# EAGLE design hs-64-spi-3d (EAGLE 9.6.2)
DESIGNER: JON NEWMAN, JAKOB VOIGTS; DESIGN_NAME: HEADSTAGE-64; LICENSE: CERN OHL v1.2; REVISION: 1.2
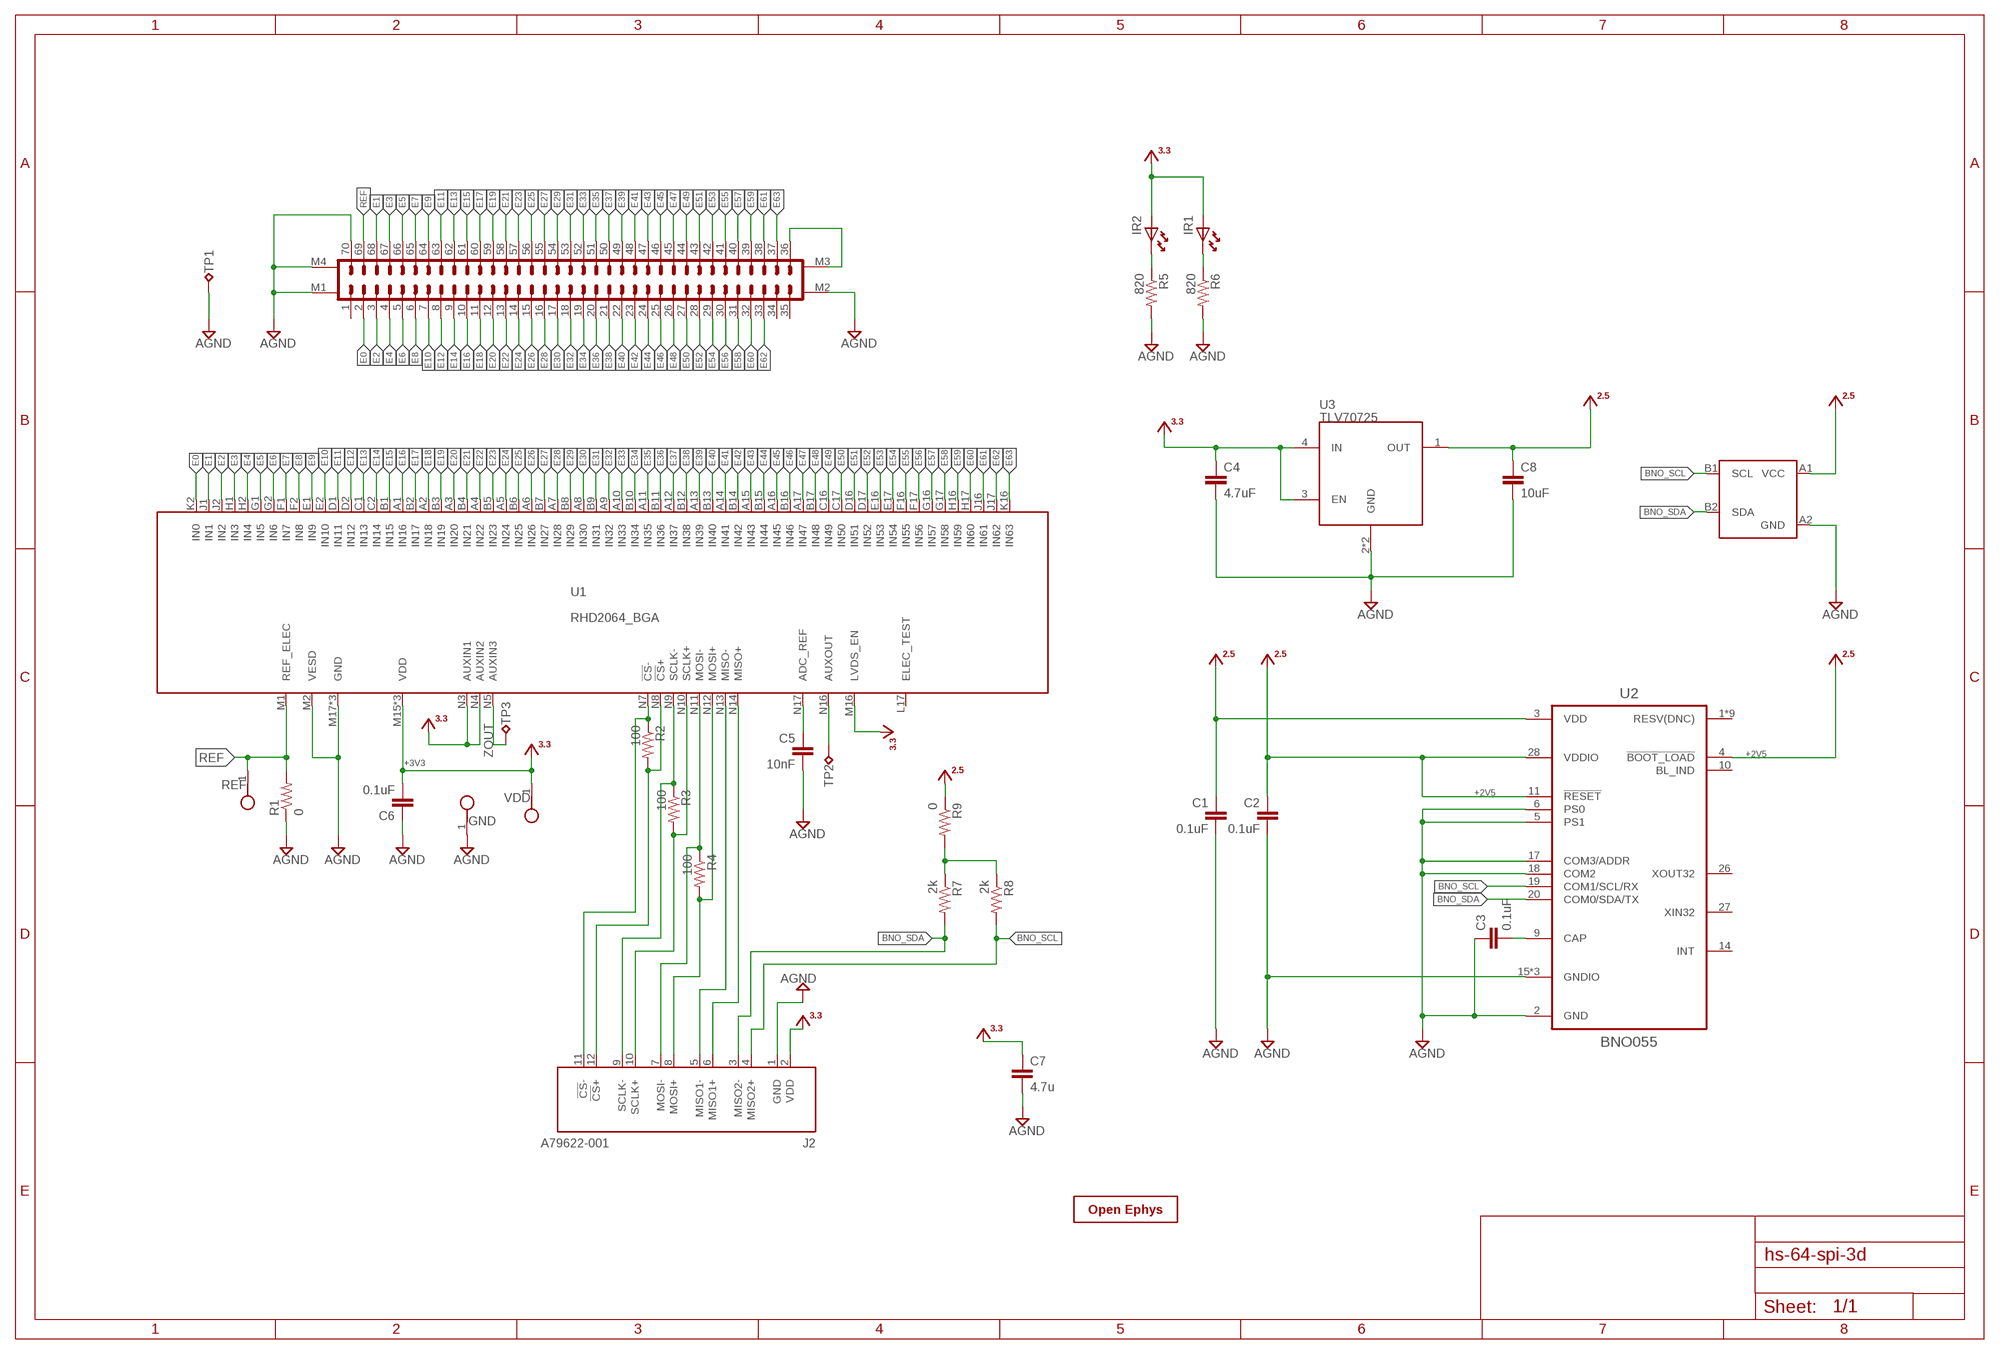
[diagram p0: schematic, sheet 1]

## Parts
C1  0.1uF  C_0402T  [0402T]
C2  0.1uF  C_0402T  [0402T]
C3  0.1uF  C_0201T  [0201T]
C4  4.7uF  C_0402T  [0402T]
C5  10nF  C_0402T  [0402T]
C6  0.1uF  C_0402T  [0402T]
C7  4.7u  C_0402  [0402]
C8  10uF  C_0402T  [0402T]
GND  TESTPOINT_SMALL  [TESTPOINT_SMALL]
IR1  LEDHAND  [LED_HAND]
IR2  LEDHAND  [LED_HAND]
J1  DF40C-70DP-0.4V(51)  PINHD-2X35+4DF40-70HEAD-LESS-SILK  [DF40-70HEAD-LESS-SILK]
J2  A79622-001  [A79622-001]
R1  0  R_0603  [0603]
R2  100  R_0402  [0402]
R3  100  R_0402  [0402]
R4  100  R_0402  [0402]
R5  820  R_0402  [0402]
R6  820  R_0402  [0402]
R7  2k  R_0201T  [0201T]
R8  2k  R_0201T  [0201T]
R9  0  R_0201T  [0201T]
REF  TESTPOINT_SMALL  [TESTPOINT_SMALL]
TP1  VCC  TPTP07R  [TP07R]
TP2  VCC  TPTP07R  [TP07R]
TP3  VCC  TPTP07R  [TP07R]
U1  RHD2064_BGA  RHD2164_BGA_BGA  [BGA104_0.5MM]
U2  BNO055  [LGA-28-3.8X5.2]
U3  TLV70725  TLV707  [X2SON]
U4  24CW640T-I/CS0668  [4-BALL_WAFFER_0.4MMX0.4MM]
VDD  TESTPOINT_SMALL  [TESTPOINT_SMALL]
X  OE-LOGO_3.5X2.5  [OE-LOGO-3.5X2.5]

## Nets
+2V5: C1.1 C2.1 C8.1 R9.1 U2.3(VDD) U2.4(!BOOT_LOAD) U2.11(!RESET) U2.28(VDDIO) U3.1(OUT) U4.A1(VCC)
+3V3: C4.1 C6.2 C7.1 IR1.A IR2.A J2.2(VDD) U1.M15(VDD) U1.M16(LVDS_EN) U1.N2(VDD) U1.N3(AUXIN1) U1.N4(AUXIN2) U1.N15(VDD) U3.3(EN) U3.4(IN) VDD.1
AGND: C1.2 C2.2 C3.1 C4.2 C5.2 C6.1 C7.2 C8.2 GND.1 J1.70 J1.M1 J1.M2 J1.M4 J2.1(GND) R1.1 R5.2 R6.2 TP1.TP U1.M2(VESD) U1.M17(GND) U1.N1(GND) U1.N6(GND) U2.2(GND) U2.5(PS1) U2.6(PS0) U2.15(GNDIO) U2.16(GNDIO) U2.17(COM3/ADDR) U2.18(COM2) U2.25(GNDIO) U3.2(GND) U3.PAD(GND) U4.A2(GND)
BNO_SCL: J2.4(MISO2+) R8.2 U2.19(COM1/SCL/RX) U4.B1(SCL)
BNO_SDA: J2.3(MISO2-) R7.2 U2.20(COM0/SDA/TX) U4.B2(SDA)
E0: J1.2 U1.K2(IN0)
E1: J1.68 U1.J1(IN1)
E2: J1.3 U1.J2(IN2)
E3: J1.67 U1.H1(IN3)
E4: J1.4 U1.H2(IN4)
E5: J1.66 U1.G1(IN5)
E6: J1.5 U1.G2(IN6)
E7: J1.65 U1.F1(IN7)
E8: J1.6 U1.F2(IN8)
E9: J1.64 U1.E1(IN9)
E10: J1.7 U1.E2(IN10)
E11: J1.63 U1.D1(IN11)
E12: J1.8 U1.D2(IN12)
E13: J1.62 U1.C1(IN13)
E14: J1.9 U1.C2(IN14)
E15: J1.61 U1.B1(IN15)
E16: J1.10 U1.A1(IN16)
E17: J1.60 U1.B2(IN17)
E18: J1.11 U1.A2(IN18)
E19: J1.59 U1.B3(IN19)
E20: J1.12 U1.A3(IN20)
E21: J1.58 U1.B4(IN21)
E22: J1.13 U1.A4(IN22)
E23: J1.57 U1.B5(IN23)
E24: J1.14 U1.A5(IN24)
E25: J1.56 U1.B6(IN25)
E26: J1.15 U1.A6(IN26)
E27: J1.55 U1.B7(IN27)
E28: J1.16 U1.A7(IN28)
E29: J1.54 U1.B8(IN29)
E30: J1.17 U1.A8(IN30)
E31: J1.53 U1.B9(IN31)
E32: J1.18 U1.A9(IN32)
E33: J1.52 U1.A10(IN33)
E34: J1.19 U1.B10(IN34)
E35: J1.51 U1.A11(IN35)
E36: J1.20 U1.B11(IN36)
E37: J1.50 U1.A12(IN37)
E38: J1.21 U1.B12(IN38)
E39: J1.49 U1.A13(IN39)
E40: J1.22 U1.B13(IN40)
E41: J1.48 U1.A14(IN41)
E42: J1.23 U1.B14(IN42)
E43: J1.47 U1.A15(IN43)
E44: J1.24 U1.B15(IN44)
E45: J1.46 U1.A16(IN45)
E46: J1.25 U1.B16(IN46)
E47: J1.45 U1.A17(IN47)
E48: J1.26 U1.B17(IN48)
E49: J1.44 U1.C16(IN49)
E50: J1.27 U1.C17(IN50)
E51: J1.43 U1.D16(IN51)
E52: J1.28 U1.D17(IN52)
E53: J1.42 U1.E16(IN53)
E54: J1.29 U1.E17(IN54)
E55: J1.41 U1.F16(IN55)
E56: J1.30 U1.F17(IN56)
E57: J1.40 U1.G16(IN57)
E58: J1.31 U1.G17(IN58)
E59: J1.39 U1.H16(IN59)
E60: J1.32 U1.H17(IN60)
E61: J1.38 U1.J16(IN61)
E62: J1.33 U1.J17(IN62)
E63: J1.37 U1.K16(IN63)
N$1: R7.1 R8.1 R9.2
N$3: IR2.K R5.1
N$4: IR1.K R6.1
N$36: C5.1 U1.N17(ADC_REF)
N$39: TP2.TP U1.N16(AUXOUT)
N$67: C3.2 U2.9(CAP)
REF: J1.69 R1.2 REF.1 U1.M1(REF_ELEC)
RHD_CLK_N [diff]: J2.9(SCLK-) R3.1 U1.N9(SCLK-)
RHD_CLK_P [diff]: J2.10(SCLK+) R3.2 U1.N10(SCLK+)
RHD_CS_N [diff]: J2.11(!CS!-) R2.1 U1.N7(!CS!-)
RHD_CS_P [diff]: J2.12(!CS!+) R2.2 U1.N8(!CS!+)
RHD_MISO_N [diff]: J2.5(MISO1-) U1.N13(MISO-)
RHD_MISO_P [diff]: J2.6(MISO1+) U1.N14(MISO+)
RHD_MOSI_N [diff]: J2.7(MOSI-) R4.1 U1.N11(MOSI-)
RHD_MOSI_P [diff]: J2.8(MOSI+) R4.2 U1.N12(MOSI+)
VCOAX: J1.36 J1.M3
ZOUT: TP3.TP U1.N5(AUXIN3)
Unconnected: J1.1 J1.34 J1.35 U1.L17(ELEC_TEST) U2.1(RESV(DNC)) U2.7(RESV(DNC)) U2.8(RESV(DNC)) U2.10(BL_IND) U2.12(RESV(DNC)) U2.13(RESV(DNC)) U2.14(INT) U2.21(RESV(DNC)) U2.22(RESV(DNC)) U2.23(RESV(DNC)) U2.24(RESV(DNC)) U2.26(XOUT32) U2.27(XIN32)

## Library data of the parts
C1-C3 C6 C7 = jonnew:C: Capacitor
C4 = jonnew:C: Capacitor; PARTNO: CL05A105KO5NNNC
C5 = jonnew:C: Capacitor; PARTNO: GRM033R71E103KE14D
C8 = jonnew:C: Capacitor; PARTNO: CL05A106MQ5NUNC
GND REF VDD = RHD2000_eval_board:TESTPOINT: PCB Test Point
IR1 IR2 = CNP-miscellaneous:LED
J1 = jonnew:PINHD-2X35+4
J2 = hs-64-spi:A79622-001
R1 = jonnew:R: Resistor; DK: PxxxxHTR-ND; MN: Panasonic; MPN: ERJ-3EKFxxxxV
R2-R9 = jonnew:R: Resistor
TP1-TP3 = jonnew:TP: Test pad
U1 = jonnew:RHD2164_BGA: Intan Technologies RHD2164 chip
U2 = jonnew:BNO055
U3 = jonnew:TLV707
U4 = 24CW640T-I_CS0668:24CW640T-I/CS0668
X = jonnew:OE-LOGO

## Net classes
1 thick: width 0.102 mm
2 diff: width 0.076 mm, drill 0.1 mm, clearance 0.051 mm

## Board
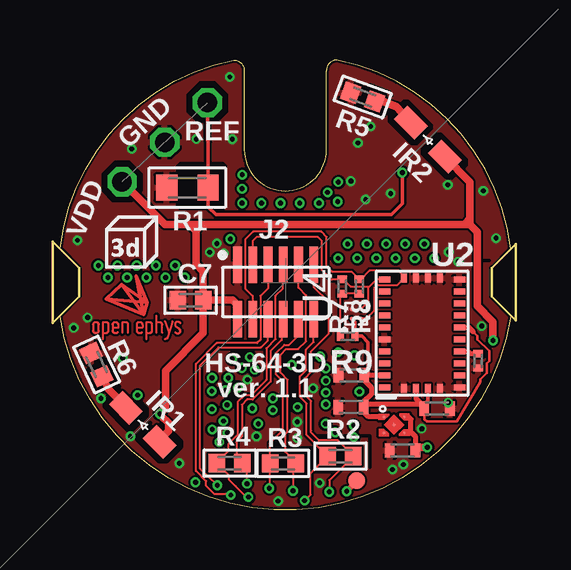
[diagram p1: board, top side]
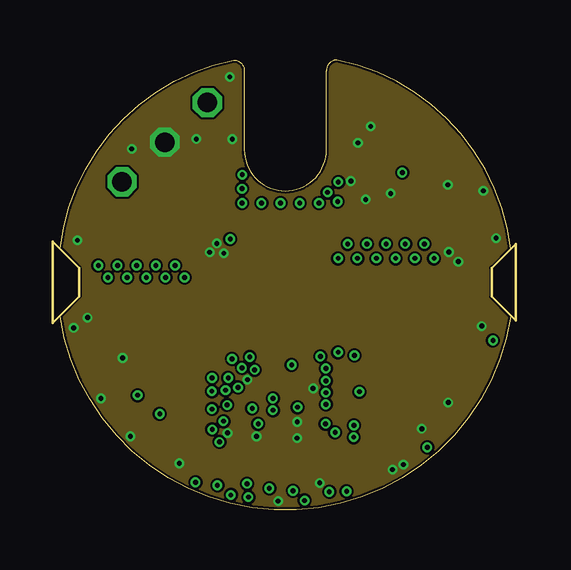
[diagram p2: board, inner layer PWR]
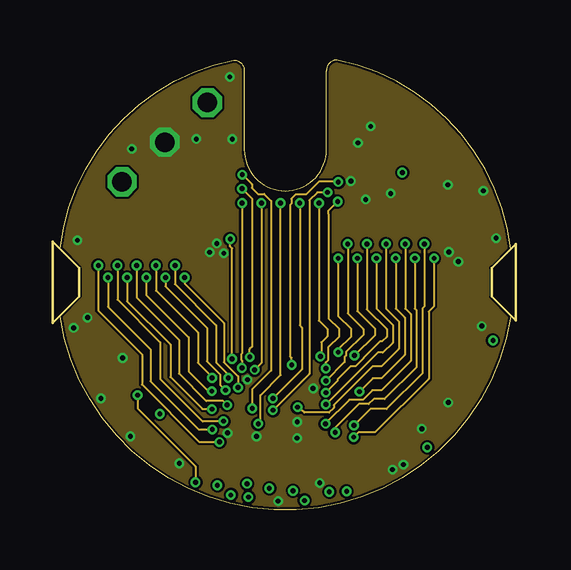
[diagram p3: board, inner layer GND]
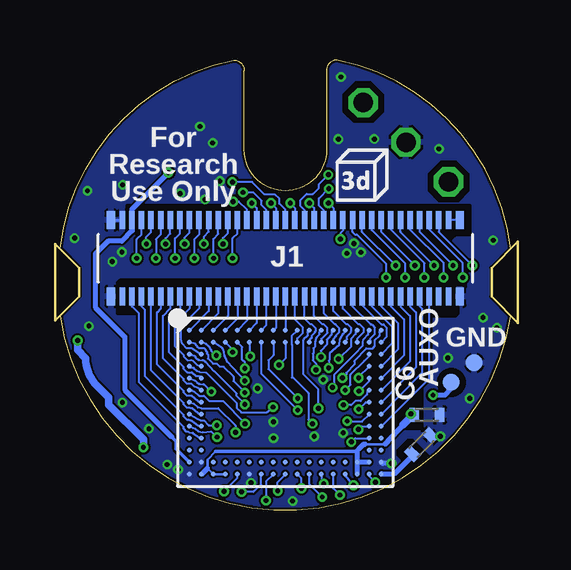
[diagram p4: board, bottom side, seen from below]

Size 18.8 x 18.76 mm. Coordinates in mm from the lower left corner, seen from the top.
Outline: 0,10.89 0.8,10.09 0.8,8.89 0,8.09 arc163 18.8,8.09 18,8.89 18,10.09 18.8,10.89 arc72 11.56,18.76 arc90 11.11,18.32 11.11,15.02 arc-90 9.4,13.3 arc-90 7.69,15.02 7.69,18.32 arc90 7.24,18.76 arc72 0,10.89
Copper layers (1*2+3*16): Top 0.035mm / dielectric 0.2mm / PWR 0.0175mm / dielectric 0.3mm / GND 0.035mm / dielectric 0.2mm / Bottom 0.035mm
Design rules "seeed-studio-4-layer *": minimum track width 0.09mm, minimum drill 0.2mm, track to track 0.09mm, track to pad 0.09mm, pad to pad 0.09mm, via to via 0.09mm, smd to smd 0mil, copper to edge 0.1mm, drill to drill 10mil, minimum pad ring 6mil, minimum via ring 4mil, stop-mask expansion 1mil, vias tented up to drill 100mil, thermal gap 0.1mm
tKeepout: area -0.1,6.6 to 1.4,12.4; area -0.1,6.6 to 1.4,12.4; area 17.4,6.6 to 18.9,12.4; area 17.4,6.6 to 18.9,12.4
tRestrict: 87 lines
bRestrict: area 1.9,4.8 to 3,5.9; 41 lines
Milling: 8 lines

### Footprints (pad centres in the part's own frame; a part is rotated, then mirrored left to right if it is on the bottom)
0402T = smd 0.4 x 0.6: 1 -0.533,0; 2 0.533,0
0201T = smd 0.3 x 0.4: 1 -0.3,0; 2 0.3,0
0402 = smd 0.686 x 0.762: 1 -0.533,0; 2 0.533,0
TESTPOINT_SMALL = drill 0.813 octagon: 1 0,0
LED_HAND = smd 1.2 x 0.8: A -1,0; K 1,0
DF40-70HEAD-LESS-SILK = smd 0.23 x 0.75: 1 -6.8,-1.585; 2 -6.4,-1.585; 3 -6,-1.585; 4 -5.6,-1.585; 5 -5.2,-1.585; 6 -4.8,-1.585; 7 -4.4,-1.585; 8 -4,-1.585; 9 -3.6,-1.585; 10 -3.2,-1.585; 11 -2.8,-1.585; 12 -2.4,-1.585; 13 -2,-1.585; 14 -1.6,-1.585; 15 -1.2,-1.585; 16 -0.8,-1.585; 17 -0.4,-1.585; 18 0,-1.585; 19 0.4,-1.585; 20 0.8,-1.585; 21 1.2,-1.585; 22 1.6,-1.585; 23 2,-1.585; 24 2.4,-1.585; 25 2.8,-1.585; 26 3.2,-1.585; 27 3.6,-1.585; 28 4,-1.585; 29 4.4,-1.585; 30 4.8,-1.585; 31 5.2,-1.585; 32 5.6,-1.585; 33 6,-1.585; 34 6.4,-1.585; 35 6.8,-1.585; 36 6.8,1.585; 37 6.4,1.585; 38 6,1.585; 39 5.6,1.585; 40 5.2,1.585; 41 4.8,1.585; 42 4.4,1.585; 43 4,1.585; 44 3.6,1.585; 45 3.2,1.585; 46 2.8,1.585; 47 2.4,1.585; 48 2,1.585; 49 1.6,1.585; 50 1.2,1.585; 51 0.8,1.585; 52 0.4,1.585; 53 0,1.585; 54 -0.4,1.585; 55 -0.8,1.585; 56 -1.2,1.585; 57 -1.6,1.585; 58 -2,1.585; 59 -2.4,1.585; 60 -2.8,1.585; 61 -3.2,1.585; 62 -3.6,1.585; 63 -4,1.585; 64 -4.4,1.585; 65 -4.8,1.585; 66 -5.2,1.585; 67 -5.6,1.585; 68 -6,1.585; 69 -6.4,1.585; 70 -6.8,1.585 | smd 0.35 x 0.75: M1 -7.275,-1.585; M2 7.275,-1.585; M3 7.275,1.585; M4 -7.275,1.585
A79622-001 = smd 0.36 x 1.524: 1 -1.587,1.143; 2 -1.587,-1.143; 3 -0.953,1.143; 4 -0.953,-1.143; 5 -0.318,1.143; 6 -0.318,-1.143; 7 0.318,1.143; 8 0.318,-1.143; 9 0.953,1.143; 10 0.953,-1.143; 11 1.587,1.143; 12 1.587,-1.143
0603 = smd 0.889 x 1.067: 1 -0.864,0; 2 0.864,0
TP07R = smd 0.7 x 0.7: TP 0,0
BGA104_0.5MM = smd 0.2 x 0.2: A1 -4,3; A2 -3.5,3; A3 -3,3; A4 -2.5,3; A5 -2,3; A6 -1.5,3; A7 -1,3; A8 -0.5,3; A9 0,3; A10 0.5,3; A11 1,3; A12 1.5,3; A13 2,3; A14 2.5,3; A15 3,3; A16 3.5,3; A17 4,3; B1 -4,2.5; B2 -3.5,2.5; B3 -3,2.5; B4 -2.5,2.5; B5 -2,2.5; B6 -1.5,2.5; B7 -1,2.5; B8 -0.5,2.5; B9 0,2.5; B10 0.5,2.5; B11 1,2.5; B12 1.5,2.5; B13 2,2.5; B14 2.5,2.5; B15 3,2.5; B16 3.5,2.5; B17 4,2.5; C1 -4,2; C2 -3.5,2; C16 3.5,2; C17 4,2; D1 -4,1.5; D2 -3.5,1.5; D16 3.5,1.5; D17 4,1.5; E1 -4,1; E2 -3.5,1; E16 3.5,1; E17 4,1; F1 -4,0.5; F2 -3.5,0.5; F16 3.5,0.5; F17 4,0.5; G1 -4,0; G2 -3.5,0; G16 3.5,0; G17 4,0; H1 -4,-0.5; H2 -3.5,-0.5; H16 3.5,-0.5; H17 4,-0.5; J1 -4,-1; J2 -3.5,-1; J16 3.5,-1; J17 4,-1; K1 -4,-1.5; K2 -3.5,-1.5; K16 3.5,-1.5; K17 4,-1.5; L1 -4,-2; L2 -3.5,-2; L16 3.5,-2; L17 4,-2; M1 -4,-2.5; M2 -3.5,-2.5; M3 -3,-2.5; M4 -2.5,-2.5; M5 -2,-2.5; M6 -1.5,-2.5; M7 -1,-2.5; M8 -0.5,-2.5; M9 0,-2.5; M10 0.5,-2.5; M11 1,-2.5; M12 1.5,-2.5; M13 2,-2.5; M14 2.5,-2.5; M15 3,-2.5; M16 3.5,-2.5; M17 4,-2.5; N1 -4,-3; N2 -3.5,-3; N3 -3,-3; N4 -2.5,-3; N5 -2,-3; N6 -1.5,-3; N7 -1,-3; N8 -0.5,-3; N9 0,-3; N10 0.5,-3; N11 1,-3; N12 1.5,-3; N13 2,-3; N14 2.5,-3; N15 3,-3; N16 3.5,-3; N17 4,-3
LGA-28-3.8X5.2 = smd 0.25 x 0.475: 1 -2.25,1.56; 6 -2.25,-1.56; 7 -1.75,-1.56; 8 -1.25,-1.56; 9 -0.75,-1.56; 10 -0.25,-1.56; 11 0.25,-1.56; 12 0.75,-1.56; 13 1.25,-1.56; 14 1.75,-1.56; 15 2.25,-1.56; 20 2.25,1.56; 21 1.75,1.56; 22 1.25,1.56; 23 0.75,1.56; 24 0.25,1.56; 25 -0.25,1.56; 26 -0.75,1.56; 27 -1.25,1.56; 28 -1.75,1.56 | smd 0.375 x 0.25: 2 -2.3,0.75; 3 -2.3,0.25; 4 -2.3,-0.25; 5 -2.3,-0.75; 16 2.3,-0.75; 17 2.3,-0.25; 18 2.3,0.25; 19 2.3,0.75
X2SON = smd 0.1 x 0.1: 1 -0.43,0.33; 2 -0.43,-0.33; 3 0.43,-0.33; 4 0.43,0.33 | smd 0.1 x 0.1 rotated 45: PAD 0,0
4-BALL_WAFFER_0.4MMX0.4MM = smd 0.163 x 0.163: A1 0,0; A2 0.4,0; B1 0,-0.4; B2 0.4,-0.4

### Placement (x,y rotation side)
C1  15.73,4.23 0 top
C2  12.15,5.61 180 top
C3  17.44,6.22 90 top
C4  14.29,2.48 180 top
C5  3.73,2.72 45 bottom
C6  3.5,3.96 180 bottom
C7  5.45,8.75 180 top
C8  12.13,4.29 180 top
GND  4.37,15.33 0 top
IR1  3.46,3.55 135 top
IR2  15.34,15.44 135 top
J1  9.4,10.49 0 bottom
J2  8.99,9.09 0 top
R1  5.32,13.44 0 top
R2  11.7,2.24 180 top
R3  9.3,1.94 180 top
R4  7.08,1.95 0 top
R5  12.63,17.22 160 top
R6  1.53,6.06 115 top
R7  11.77,9.31 90 top
R8  12.49,9.31 90 top
R9  12,7.24 180 top
REF  6.15,16.99 0 top
TP1  1.52,6.14 0 bottom
TP2  2.48,5.32 0 bottom
TP3  12.38,1.21 0 top
U1  9.4,4.49 0 bottom
U2  15.1,7.36 90 top
U3  13.93,3.55 0 top
U4  12.16,7.97 90 top
VDD  2.59,13.68 0 top
X  3.03,8.05 0 top

### Tracks (layer width: path | path; a pad name or v marks a point on that pad's centre or on a via)
+2V5
  Top 0.1: C1.1 15.19,3.78 15.29,3.68 16.55,3.68 17.54,5.34 17.54,5.44 17.81,5.71 17.81,6.11 17.9,6.2 17.9,6.64 17.41,7.12 17.41,7.24 17.23,7.42
  Top 0.15: U2.4 15.35,4.57 15.14,4.36
  Top 0.152: 12.85,5.68 12.85,6.98 12.59,7.24 R9.1 12.3,7.83 U4.A1
  Top 0.203: 12.85,5.68 12.79,5.61 C2.1 | U2.28 C2.1 | C2.1 12.68,5.41 12.99,5.1 12.99,4.82 12.66,4.49 C8.1 | U3.1 12.87,3.88 12.66,4.09 C8.1 | U2.3 14.85,4.64 15.14,4.36 15.19,4.3 C1.1 15.03,4.39 12.77,4.39 C8.1 | U2.11 17.04,7.61 17.23,7.42
+3V3  (via drill 0.2)
  Top 0.203: U3.3 14.66,3.22 | 14.66,3.22 14.67,3.22 14.82,3.07 C4.1 | U3.4 14.54,3.88 14.64,3.78 14.64,3.23 14.66,3.22
  Top 0.305: IR1.A 4.16,2.94 4.52,3.3 4.52,3.63 4.24,3.91 v4.16,4 4.4,4.24 4.4,5.79 5.98,7.37 C7.1 | 5.91,11.89 17.1,11.89 | 5.91,11.89 5.67,11.65 | 17.1,11.89 17.4,11.59 17.4,8.49 18.06,7.83 v18.06,7.07 | 17.1,11.89 17.1,12.14 | 5.91,11.89 4.38,11.89 VDD.1 | 5.43,11.87 5.67,11.63 5.67,11.65 | 5.67,11.65 5.67,10.26 5.98,9.95 C7.1 | C7.1 7.2,8.75 7.41,8.54 J2.2 | v15.32,2.61 14.95,2.61 C4.1 | IR2.A 17.1,13.68 17.1,12.14 | 17.1,12.14 16.86,11.9
  Bottom 0.09: 5.3,2.73 5.25,2.73 5.24,2.74
  Bottom 0.1: 12.31,2.43 12.65,2.09 12.65,1.74 U1.N3 U1.N4 | 6.07,2.73 5.3,2.73 | 6.36,2.52 6.4,2.47 6.4,2.43
  Bottom 0.15: 6.4,2.43 12.31,2.43
  Bottom 0.152: U1.M15 6.4,2.43 | C6.2 4.52,3.5 4.59,3.43
  Bottom 0.2: U1.N2 12.65,1.74 | 5.11,2.91 4.52,3.5 4.5,3.52 4.5,3.55 | 5.11,2.91 5.11,2.87 5.24,2.74 | 6.36,2.52 6.14,2.73 6.07,2.73 | U1.M15 6.4,2.47 | U1.N15 U1.M15 | 4.59,3.43 5.11,2.91 | U1.M16 U1.M15
  Bottom 0.3: 4.29,3.75 4.01,4.03 v4.16,4
  Bottom 0.305: 4.29,3.75 4.5,3.55 | v18.06,7.07 18.06,6.66 17.73,6.32 arc-45 17.25,5.18 16.77,4.69 16.77,4.39 15.32,2.94 v15.32,2.61
AGND  (via drill 0.2 pad 0.25)
  Bottom 0.127: J1.M4 J1.70
  Bottom 0.2: v4.98,1.94 5.35,1.94 U1.M17
  other vias: 17.66,13.3 13.79,13.19 12.75,12.94 12.13,13.71 13.87,1.68 7.19,15.46 12.96,15.99 14.33,1.89 9.89,2.99 6.54,11.11 6.25,10.74 6.84,10.7 16.22,10.76 1.71,4.65 0.58,7.59 2.62,6.34 1.15,8.02 16.19,4.48 16.18,13.56 12.43,15.3 7.08,18.05 0.73,11.24 18.19,11.33 10.56,5.07 10.83,1.12 5.69,15.47 16.62,10.35 8.2,3.07 9.9,3.67 6.99,3.21 9.1,0.37 2.94,3.06 7.82,5.43 2.99,15.06 15.09,3.38 17.59,7.66
  pour Top (isolate 0.05, rank 3): -2,19.29 19.6,19.29 19.6,-0.61 -2,-0.61
  pour GND (isolate 0.05, rank 3, no thermals): -1.8,19.09 19.8,19.09 19.8,-0.81 -1.8,-0.81
  pour Bottom (isolate 0.05, rank 3): -1.7,18.99 19.9,18.99 19.9,-0.91 -1.7,-0.91
  pour PWR (isolate 0.05, rank 3, no thermals): -1.9,19.19 19.7,19.19 19.7,-0.71 -1.9,-0.71
BNO_SCL
  Top 0.085: 13.84,9.37 13.23,9.37 13.2,9.32
  Top 0.09: J2.4 8.04,8.92 7.72,9.24 7.72,11.27 8.05,11.6 10.9,11.6 11.12,11.38 11.12,10.16 11.36,9.92 12.18,9.92 R8.2 12.55,9.61 12.91,9.98 14.11,9.98 14.34,9.75 14.34,9.68 U2.19 14.05,9.37 13.84,9.37 | 13.2,9.32 13.1,9.23 13.1,8.3 12.77,7.97 U4.B1
BNO_SDA
  Top 0.09: U2.20 13.21,9.61 12.91,9.32 | 12.91,9.32 12.87,9.28 12.87,8.68 U4.B2 | 12.91,9.32 12.12,9.32 11.83,9.61 R7.2 11.76,9.6 11.33,9.6 10.92,10 10.92,11.22 10.76,11.38 8.21,11.38 8.04,11.22 J2.3
E0
  Bottom 0.09: 15.8,8.49 15.5,8.19 15.5,5.32 13.64,3.45 13.64,3.4 13.53,3.26 13.47,3.26 13.43,3.24 13.26,3.21 12.99,3.02 U1.K2
  Bottom 0.1: J1.2 15.8,8.49
E1  (via drill 0.2)
  GND 0.09: v15.6,10.49 15.6,8.49 15.38,8.27 15.38,5.47 13.14,3.24 12.45,3.24 v12.25,3.03
  Bottom 0.09: J1.68 15.4,11.49 15.6,11.29 v15.6,10.49 | U1.J1 13.25,3.41 13.16,3.39 13.01,3.27 12.85,3.23 12.5,3.27 v12.26,3.03 v12.25,3.03
E2
  Bottom 0.09: J1.3 15.4,8.49 15.25,8.34 15.25,5.57 13.64,3.95 13.64,3.89 13.5,3.75 13.41,3.75 13.37,3.74 13.29,3.71 13.04,3.53 U1.J2
E3  (via drill 0.2)
  GND 0.09: v15.2,11.09 15.2,8.49 15.12,8.42 15.12,5.72 13.62,4.21 12.94,4.21 v12.26,3.53
  Bottom 0.09: J1.67 15,11.58 15.2,11.38 v15.2,11.09 | U1.H1 13.07,3.79 12.94,3.74 12.93,3.73 12.79,3.73 12.59,3.53 v12.26,3.53
E4
  Bottom 0.09: J1.4 15,5.82 13.64,4.45 13.64,4.39 13.5,4.26 13.38,4.26 13.36,4.24 13.3,4.24 13.04,4.02 U1.H2
E5  (via drill 0.2)
  GND 0.09: v14.8,10.49 14.8,8.39 14.88,8.32 14.88,5.97 13.54,4.63 13.09,4.63 12.87,4.41 12.46,4.41 11.48,3.43 v11.48,3.23
  Bottom 0.09: v14.8,10.49 14.8,11.29 14.6,11.49 J1.66 | U1.G1 13.23,4.43 13.04,4.27 12.9,4.24 12.2,4.24 11.48,3.52 v11.48,3.23
E6
  Bottom 0.09: J1.5 14.6,8.39 14.75,8.24 14.75,6.07 13.64,4.95 13.64,4.89 13.5,4.76 13.31,4.76 13.04,4.52 U1.G2
E7  (via drill 0.2)
  GND 0.09: v14.4,11.09 14.4,8.39 14.62,8.17 14.62,6.22 U1.F1 13.03,4.99 12.63,4.59 12.07,4.59 v11.08,3.6 v11.08,3.59
  Bottom 0.09: J1.65 14.2,11.52 14.4,11.32 v14.4,11.09 | U1.F1 13.3,4.99 13.27,4.96 13.21,4.93 13,4.76 12.8,4.76 12.57,4.54 12,4.54 11.08,3.62 v11.08,3.59
E8
  Bottom 0.09: J1.6 14.2,8.39 14.5,8.09 14.5,6.32 13.64,5.45 13.64,5.39 13.5,5.26 13.31,5.26 13.2,5.14 13.06,5.09 U1.F2
E9  (via drill 0.2)
  GND 0.09: v14,10.49 14,8.39 14.38,8.02 14.38,6.47 U1.E1 13.05,5.49 v12.49,4.93
  Bottom 0.09: J1.64 13.8,11.52 14,11.32 v14,10.49 | U1.E1 13.17,5.39 13.09,5.32 12.99,5.26 12.83,5.24 12.81,5.23 12.8,5.23 12.5,4.93 v12.49,4.93
E10
  Bottom 0.09: J1.7 13.8,8.39 14.25,7.94 14.25,6.57 13.64,5.95 13.64,5.89 13.49,5.74 13.3,5.74 13.13,5.58 12.98,5.58 U1.E2
E11  (via drill 0.2)
  GND 0.09: v13.6,11.09 13.6,8.39 14.12,7.87 14.12,6.72 U1.D1 13.04,5.99 11.43,4.38 11.43,4.26 11.23,4.06 10.19,4.06 v9.91,4.28
  Bottom 0.09: J1.63 13.4,11.56 13.6,11.36 v13.6,11.09 | U1.D1 13.33,5.92 13.22,5.92 13.09,5.8 12.98,5.76 12.71,5.72 11.43,4.46 11.43,4.26 11.23,4.06 10.19,4.06 v9.91,4.28
E12
  Bottom 0.09: J1.8 13.4,8.39 14,7.79 14,6.82 13.64,6.45 13.64,6.39 13.48,6.24 13.34,6.25 13.26,6.22 13.08,6.04 U1.D2
E13  (via drill 0.2)
  GND 0.09: v13.2,10.49 13.2,8.39 13.88,7.72 13.88,6.97 13.46,6.56 13.25,6.56 v11.09,4.4
  Bottom 0.09: v13.2,10.49 13.2,11.28 13,11.48 J1.62 | U1.C1 13.38,6.45 13.3,6.46 13.2,6.42 13.13,6.36 13.01,6.26 12.86,6.24 12.84,6.24 12.74,6.17 12.37,5.78 12.36,5.78 11.43,4.85 11.43,4.75 11.09,4.41 v11.09,4.4
E14
  Bottom 0.09: J1.9 13,8.39 13.75,7.64 13.75,7.09 13.71,6.94 13.52,6.74 13.32,6.73 12.96,6.51 U1.C2
E15  (via drill 0.2)
  GND 0.09: v12.8,11.09 12.8,8.37 13.62,7.54 13.62,7.22 13.45,7.04 13.36,7.04 12.67,6.34 12.67,6.32 12.33,5.98 12.12,5.98 11.58,5.44 11.58,5.38 v11.09,4.89
  Bottom 0.09: J1.61 12.6,11.6 12.8,11.4 v12.8,11.09 | U1.B1 13.21,6.95 13.08,6.82 13,6.76 12.79,6.75 12.72,6.69 12.67,6.59 12.67,6.51 12.63,6.47 12.63,6.31 12.42,6.11 12.27,6.11 12.13,5.96 11.97,5.96 11.57,5.56 11.57,5.37 v11.09,4.89
E16
  Bottom 0.09: U1.A1 12.6,8.29 J1.10
E17  (via drill 0.2)
  GND 0.09: v12.4,10.49 12.4,8.29 13.15,7.54 13.15,7.29 v12.28,6.44
  Bottom 0.09: J1.60 12.2,11.5 12.4,11.3 v12.4,10.49 | v12.28,6.44 12.48,6.6 12.47,6.62 12.48,6.64 12.48,6.66 12.52,6.71 12.55,6.75 12.55,6.78 12.58,6.81 12.61,6.84 12.64,6.85 12.66,6.87 12.7,6.91 12.72,6.92 12.74,6.93 12.86,6.95 U1.B2
E18
  Bottom 0.09: U1.A2 12.2,8.19 J1.11
E19  (via drill 0.2)
  GND 0.09: v12,11.09 12,8.19 12.65,7.54 12.65,7.29 11.94,6.58 11.94,6.43 11.87,6.37 11.87,6.17 v11.09,5.38
  Bottom 0.09: J1.59 11.8,11.54 12,11.34 v12,11.09 | v11.09,5.38 11.84,6.18 11.88,6.32 11.93,6.42 11.97,6.6 12,6.71 12.04,6.77 12.34,6.99 U1.B3
E20
  Bottom 0.09: U1.A3 11.8,8.09 J1.12
E21  (via drill 0.2)
  GND 0.09: v11.6,10.49 11.6,8.09 12.15,7.54 12.15,7.24 11.6,6.69 v11.6,6.57
  Bottom 0.09: J1.58 11.4,11.53 11.6,11.33 v11.6,10.49 | v11.6,6.57 11.66,6.75 U1.B4
E22
  Bottom 0.09: U1.A4 11.4,7.99 J1.13
E23  (via drill 0.2)
  GND 0.09: v11.09,5.9 11.09,6.15 11.2,6.26 11.2,6.79 11.65,7.24 11.65,7.54 11.2,7.99 11.2,12.29 11.2,12.33 11.2,12.48 v11.58,12.86
  Bottom 0.09: J1.57 11,12.52 11.34,12.86 v11.58,12.86 | v11.09,5.9 11.09,6.15 11.2,6.26 11.2,6.79 U1.B5
E24
  Bottom 0.09: U1.A5 11,7.89 J1.14
E25  (via drill 0.2)
  GND 0.09: v10.8,12.79 10.8,7.89 11.15,7.54 11.15,7.24 U1.B6 10.9,6.44 v10.86,6.4
  Bottom 0.09: U1.B6 10.9,6.44 v10.86,6.4 | v10.8,12.79 10.6,12.59 J1.56
E26
  Bottom 0.09: U1.A6 10.6,7.79 J1.15
E27  (via drill 0.2)
  GND 0.09: v8.88,4.16 10.4,5.68 10.4,12.91 10.73,13.24 v11.16,13.24
  Bottom 0.09: v8.88,4.16 10.4,5.68 U1.B7 | J1.55 10.2,12.52 10.39,12.71 10.39,12.9 10.74,13.24 v11.16,13.24
E28
  Bottom 0.09: U1.A7 10.2,7.69 J1.16
E29  (via drill 0.2)
  GND 0.09: v10,12.79 10,7.69 10.09,7.6 10.09,5.86 v8.88,4.65
  Bottom 0.09: U1.B8 9.9,6.44 10.1,6.24 10.1,5.87 v8.88,4.65 | v10,12.79 9.8,12.59 J1.54
E30
  Bottom 0.09: U1.A8 9.8,7.59 J1.17
E31  (via drill 0.2)
  GND 0.09: v9.67,6.05 9.67,6.35 9.6,6.41 9.6,12.72 9.65,12.77 9.65,12.97 9.83,13.15 10.26,13.15 10.8,13.68 11.6,13.68 v11.61,13.67
  Bottom 0.09: U1.B9 9.4,6.31 v9.67,6.05 | J1.53 9.4,12.52 9.65,12.77 9.65,12.97 9.83,13.15 10.26,13.15 10.79,13.67 v11.61,13.67
E32
  Bottom 0.09: J1.18 U1.A9
E33  (via drill 0.2)
  GND 0.09: v9.2,12.79 9.2,5.62 8.36,4.78 8.36,3.68 v8.27,3.59
  Bottom 0.09: U1.A10 9.13,7.26 9.13,6.9 9.13,6.89 9.13,5.52 9.09,5.52 8.44,4.87 8.44,3.76 v8.27,3.59 | v9.2,12.79 9,12.59 J1.52
E34
  Bottom 0.09: J1.19 9,7.95 8.9,7.84 8.67,7.61 8.67,7.39 8.9,7.15 U1.B10
E35  (via drill 0.2)
  GND 0.09: v8.02,4.23 8.02,5.02 8.81,5.81 8.81,12.88 8.51,13.18 8.26,13.18 8,13.43 8,13.58 | v7.61,13.98 8,13.58 | 8,13.58
  Bottom 0.09: U1.A11 8.48,7.41 8.48,7.26 8.63,7.11 8.63,5.64 8.02,5.03 v8.02,4.23 | J1.51 8.6,12.5 8.77,12.67 8.77,12.92 8.51,13.18 8.26,13.18 8,13.43 8,13.58 v7.61,13.98
E36
  Bottom 0.09: J1.20 8.6,7.99 8.35,7.74 8.3,7.74 8.15,7.6 8.15,7.44 8.17,7.43 8.17,7.39 8.3,7.25 8.3,7.17 8.4,7.07 U1.B11
E37  (via drill 0.2)
  GND 0.09: v8.4,12.79 8.4,6.12 v8.12,5.84
  Bottom 0.09: U1.A12 7.97,7.42 7.97,7.33 8.11,7.18 8.13,7.08 8.13,7.04 8.15,6.99 8.15,6.82 8.23,6.74 8.23,6.53 8.25,6.51 8.25,6.23 8.12,6.1 v8.12,5.84 | v8.4,12.79 8.2,12.59 J1.50
E38
  Bottom 0.09: J1.21 8.2,8.09 7.85,7.74 7.8,7.74 7.65,7.6 7.65,7.39 7.9,7.14 U1.B12
E39  (via drill 0.2)
  GND 0.09: v7.59,13.39 8,12.99 8,6.79 7.92,6.7 v7.92,6.37
  Bottom 0.09: U1.A13 7.47,7.42 7.47,7.31 7.63,7.15 7.63,7.12 7.67,7.09 7.67,6.89 7.92,6.64 v7.92,6.37 | J1.49 7.8,12.49 8,12.69 8,12.98 v7.59,13.39
E40
  Bottom 0.09: J1.22 7.8,8.19 7.34,7.73 7.3,7.73 7.17,7.59 7.17,7.39 7.29,7.27 7.29,7.24 7.4,7.11 U1.B13
E41  (via drill 0.2)
  GND 0.09: v7.6,12.79 7.6,6.53 7.56,6.49 7.56,6.26 7.59,6.22 v7.59,5.92
  Bottom 0.09: U1.A14 6.9,7.43 6.94,7.39 6.97,7.35 7.13,7.11 7.15,6.87 7.56,6.52 7.56,6.26 7.59,6.22 v7.59,5.92 | v7.6,12.79 7.4,12.59 J1.48
E42
  Bottom 0.09: J1.23 7.4,8.29 6.85,7.74 6.8,7.74 6.65,7.6 6.65,7.45 6.67,7.42 6.67,7.39 6.82,7.23 6.83,7.22 6.83,7.12 U1.B14
E43  (via drill 0.2)
  GND 0.09: v7.1,11.29 7.1,10.99 7.18,10.91 v7.18,6.29
  Bottom 0.09: U1.A15 6.47,7.42 6.47,7.33 6.65,7.15 6.65,6.82 v7.18,6.29 | J1.47 7,11.65 7.1,11.55 v7.1,11.29
E44
  Bottom 0.09: J1.24 7,8.39 6.35,7.74 6.3,7.74 6.15,7.6 6.15,7.39 6.4,7.14 U1.B15
E45  (via drill 0.2)
  GND 0.09: v7.43,5.1 7.43,5.57 6.84,6.15 6.84,7.79 5.2,9.44 v5.2,9.69
  Bottom 0.09: U1.A16 5.95,7.44 5.95,7.31 6.15,7.11 6.17,6.98 6.17,6.85 6.2,6.82 6.47,6.53 7.35,5.64 7.35,5.18 v7.43,5.1 | J1.46 6.6,11.59 6.5,11.49 6.42,11.49 5.2,10.27 v5.2,9.69
E46
  Bottom 0.09: J1.25 6.6,8.49 5.84,7.73 5.8,7.73 5.67,7.59 5.67,7.34 5.85,7.16 5.85,7.05 U1.B16
E47  (via drill 0.2)
  GND 0.09: v7.02,5.5 7.02,5.65 6.52,6.14 6.52,7.69 4.8,9.41 v4.8,10.19
  Bottom 0.09: U1.A17 5.49,7.41 5.49,7.26 5.67,7.08 5.67,6.83 5.75,6.74 6.02,6.74 6.52,6.2 6.52,6.06 6.86,5.72 6.86,5.66 v7.02,5.5 | v4.8,10.19 6.2,11.59 J1.45
E48
  Bottom 0.09: J1.26 6.2,8.54 5.39,7.73 5.3,7.73 5.17,7.59 5.17,7.23 U1.B17
E49  (via drill 0.2)
  GND 0.09: v6.9,4.99 6.68,5.21 6.68,5.64 6.13,6.2 6.13,7.59 4.4,9.32 v4.4,9.69
  Bottom 0.09: v6.9,4.99 6.68,5.21 6.68,5.64 6.11,6.22 5.9,6.43 U1.C16 | v4.4,9.69 4.4,10.27 5.8,11.67 J1.44
E50
  Bottom 0.09: J1.27 5.8,8.49 4.95,7.64 4.95,6.94 U1.C17
E51  (via drill 0.2)
  GND 0.09: v6.34,5.5 6.34,5.55 5.76,6.14 5.76,7.39 4,9.15 v4,10.19
  Bottom 0.09: U1.D16 6.34,5.55 v6.34,5.5 | J1.43 5.4,11.59 v4,10.19
E52
  Bottom 0.09: J1.28 5.4,8.49 4.7,7.79 4.7,6.69 U1.D17
E53  (via drill 0.2)
  GND 0.09: v6.33,4.95 6.19,4.95 5.37,5.78 5.37,7.19 3.6,8.96 v3.6,9.69
  Bottom 0.09: v6.33,4.95 5.9,5.38 U1.E16 | J1.42 5,11.69 3.6,10.29 v3.6,9.69
E54
  Bottom 0.09: J1.29 5,8.49 4.45,7.94 4.45,6.44 U1.E17
E55  (via drill 0.2)
  GND 0.09: v6.98,4.37 6.81,4.54 6.1,4.54 4.96,5.68 4.96,7.09 3.2,8.85 v3.2,10.19
  Bottom 0.09: U1.F16 6,4.9 6,4.81 6.27,4.54 6.48,4.54 6.65,4.37 v6.98,4.37 | J1.41 4.6,11.59 v3.2,10.19
E56
  Bottom 0.09: J1.30 4.6,8.49 4.2,8.09 4.2,6.19 U1.F17
E57  (via drill 0.2)
  GND 0.09: v6.34,4.2 5.94,4.2 4.61,5.54 4.61,6.89 2.8,8.7 v2.8,9.69
  Bottom 0.09: v6.34,4.2 6.05,4.49 U1.G16 | J1.40 4.2,11.69 2.8,10.29 v2.8,9.69
E58
  Bottom 0.09: J1.31 4.2,8.49 3.95,8.24 3.95,5.94 U1.G17
E59  (via drill 0.2)
  GND 0.09: v6.82,3.7 6.85,3.69 5.95,3.69 4.18,5.46 4.18,6.99 2.4,8.77 v2.4,10.19
  Bottom 0.09: U1.H16 6.2,3.69 6.85,3.69 v6.82,3.7 | J1.39 3.8,11.59 v2.4,10.19
E60
  Bottom 0.09: J1.32 3.8,8.49 3.7,8.39 3.7,5.72 U1.H17
E61  (via drill 0.2)
  GND 0.09: v6.35,3.35 5.79,3.35 3.78,5.37 3.78,6.69 2,8.47 v2,9.69
  Bottom 0.09: v6.35,3.35 6.21,3.49 U1.J16 | J1.38 3.4,11.69 2,10.29 v2,9.69
E62
  Bottom 0.09: J1.33 3.4,5.49 U1.J17
E63  (via drill 0.2)
  GND 0.09: v6.65,2.83 5.81,2.83 3.42,5.22 3.42,6.49 1.6,8.31 v1.6,10.19
  Bottom 0.09: v6.65,2.83 6.49,2.99 U1.K16 | J1.37 3,11.59 v1.6,10.19
N$1
  Top 0.09: R9.2 11.7,8.94 R7.1 R8.1
N$3
  Top 0.305: R5.1 13.46,17.04 14.02,16.82 IR2.K
N$4
  Top 0.305: R6.1 2.01,5.05 2.75,4.31 IR1.K
N$36
  Bottom 0.2: U1.N17 5.39,1.51 4.85,1.51 4.11,2.25 C5.1
N$39  (via drill 0.2 pad 0.25)
  GND 0.09: v5.65,1.15 5.65,1.81 3.24,4.22 v3.24,4.78
  Bottom 0.09: U1.N16 5.9,1.4 v5.65,1.15
  Bottom 0.203: TP2.TP 2.48,5.06 2.76,4.78 v3.24,4.78
N$67
  Top 0.203: U2.9 17.01,6.61 17.11,6.52 C3.2
REF  (via drill 0.2 pad 0.25)
  Top 0.152: v14.28,14.06 14.28,12.76 13.83,12.32 6.5,12.32 6.18,12.64 R1.2 6.18,15.37 6.15,15.4 REF.1
  Bottom 0.15: U1.M1 13.95,2.54 13.95,2.86 14.14,3.05
  Bottom 0.2: 14.14,3.05 16.1,5.01 16.1,7.21 17.33,8.44 17.33,10.67 16.79,11.21 16.21,11.21 15.78,11.64 15.78,11.94 J1.69 15.8,12.54 v14.28,14.06
RHD_CLK_N  (via drill 0.2)
  Top 0.09: J2.9 9.95,9.26 10.26,8.95 10.26,7.03 9.94,6.7 9.43,6.7 9.19,6.46 9.19,5.73 9.49,5.43 9.49,3.26 9.4,3.17 9.4,2.41 9.83,1.98 R3.1 9.72,1.94 v9.72,0.79
  Bottom 0.09: v9.72,0.79 9.72,1.15 U1.N9
RHD_CLK_P  (via drill 0.2)
  Top 0.09: J2.10 9.95,7.27 9.56,6.88 9.36,6.88 9.01,6.53 9.01,5.66 9.31,5.36 9.31,3.33 8.77,2.79 R3.2 8.73,1.94 v8.73,0.9
  Bottom 0.09: v8.73,0.9 8.73,1.32 U1.N10
RHD_CS_N  (via drill 0.2)
  Top 0.09: v11.23,0.75 11.23,1.24 R2.1 11.58,2.89 10.8,2.89 10.47,3.22 10.47,3.3 | J2.11 10.58,9.3 11.21,8.67 11.21,7.36 10.47,6.62 10.47,5.75 10.21,5.49 10.21,4.79 10.47,4.54 10.47,3.3 | 10.47,3.3
  Bottom 0.09: v11.23,0.75 10.73,0.75 10.7,0.79 10.69,0.79 10.41,1.06 10.41,1.48 U1.N7
RHD_CS_P  (via drill 0.2)
  Top 0.09: v10.2,0.39 10.45,0.63 10.45,1.52 R2.2 10.29,3.12 10.29,4.44 10.01,4.72 10.01,5.57 10.26,5.82 10.27,6.69 10.58,7 J2.12
  Bottom 0.09: U1.N8 10.2,1.19 v10.2,0.39
RHD_MISO_N  (via drill 0.2)
  Top 0.09: v7.13,0.62 7.05,0.74 6.97,0.66 6.43,0.66 6.1,1 6.1,1.2 5.67,1.63 5.67,6.09 6.54,6.96 8.22,6.96 8.36,7.1 8.36,8.92 8.69,9.26 8.69,10.62 J2.5
  Bottom 0.09: v7.13,0.62 7.4,0.89 U1.N13
RHD_MISO_P  (via drill 0.2)
  Top 0.09: J2.6 8.68,7.42 8.67,7.42 8.67,7.07 8.38,6.78 6.61,6.78 5.85,6.02 5.85,1.71 6.07,1.5 6.07,1.49 6.15,1.41 v6.56,1.03
  Bottom 0.09: v6.56,1.03 6.9,1.44 U1.N14
RHD_MOSI_N  (via drill 0.2)
  Top 0.09: J2.7 9.28,10.61 9.29,10.6 9.29,9.24 8.99,8.94 8.99,7.12 8.61,6.73 8.61,5.43 7.96,4.78 7.69,4.78 7.41,4.5 7.41,3.13 7.02,2.74 7.02,2.44 6.59,2.01 6.49,1.86 6.55,1.92 R4.1 7.06,1.44 7.06,1.25 7.32,0.99 7.32,0.98 7.77,0.53 v7.86,0.53
  Bottom 0.09: v7.86,0.53 8.4,1.07 U1.N11
RHD_MOSI_P  (via drill 0.2)
  Top 0.09: J2.8 9.25,8.04 9.25,7.08 8.79,6.62 8.79,5.36 8.04,4.6 7.81,4.6 7.59,4.38 7.59,3.06 7.36,2.83 7.36,2.11 R4.2 7.8,1.77 v7.8,1.09
  Bottom 0.09: U1.N12 7.9,1.19 v7.8,1.09
VCOAX
  Bottom 0.09: J1.M3 J1.36
ZOUT  (via drill 0.2)
  Top 0.203: v11.96,0.77 v11.96,0.78 TP3.TP
  Bottom 0.09: v11.96,0.77 11.4,1.33 U1.N5

### Text on the board
tPlace: HS-64-3D / ver. 1.1
bPlace: For / Research / Use Only | GND | AUXO
Measures: Low / Profile / Headstage